# Altium schematic sheet Input.SchDoc
size A3; SheetNumber: 2; SheetTotal: 4
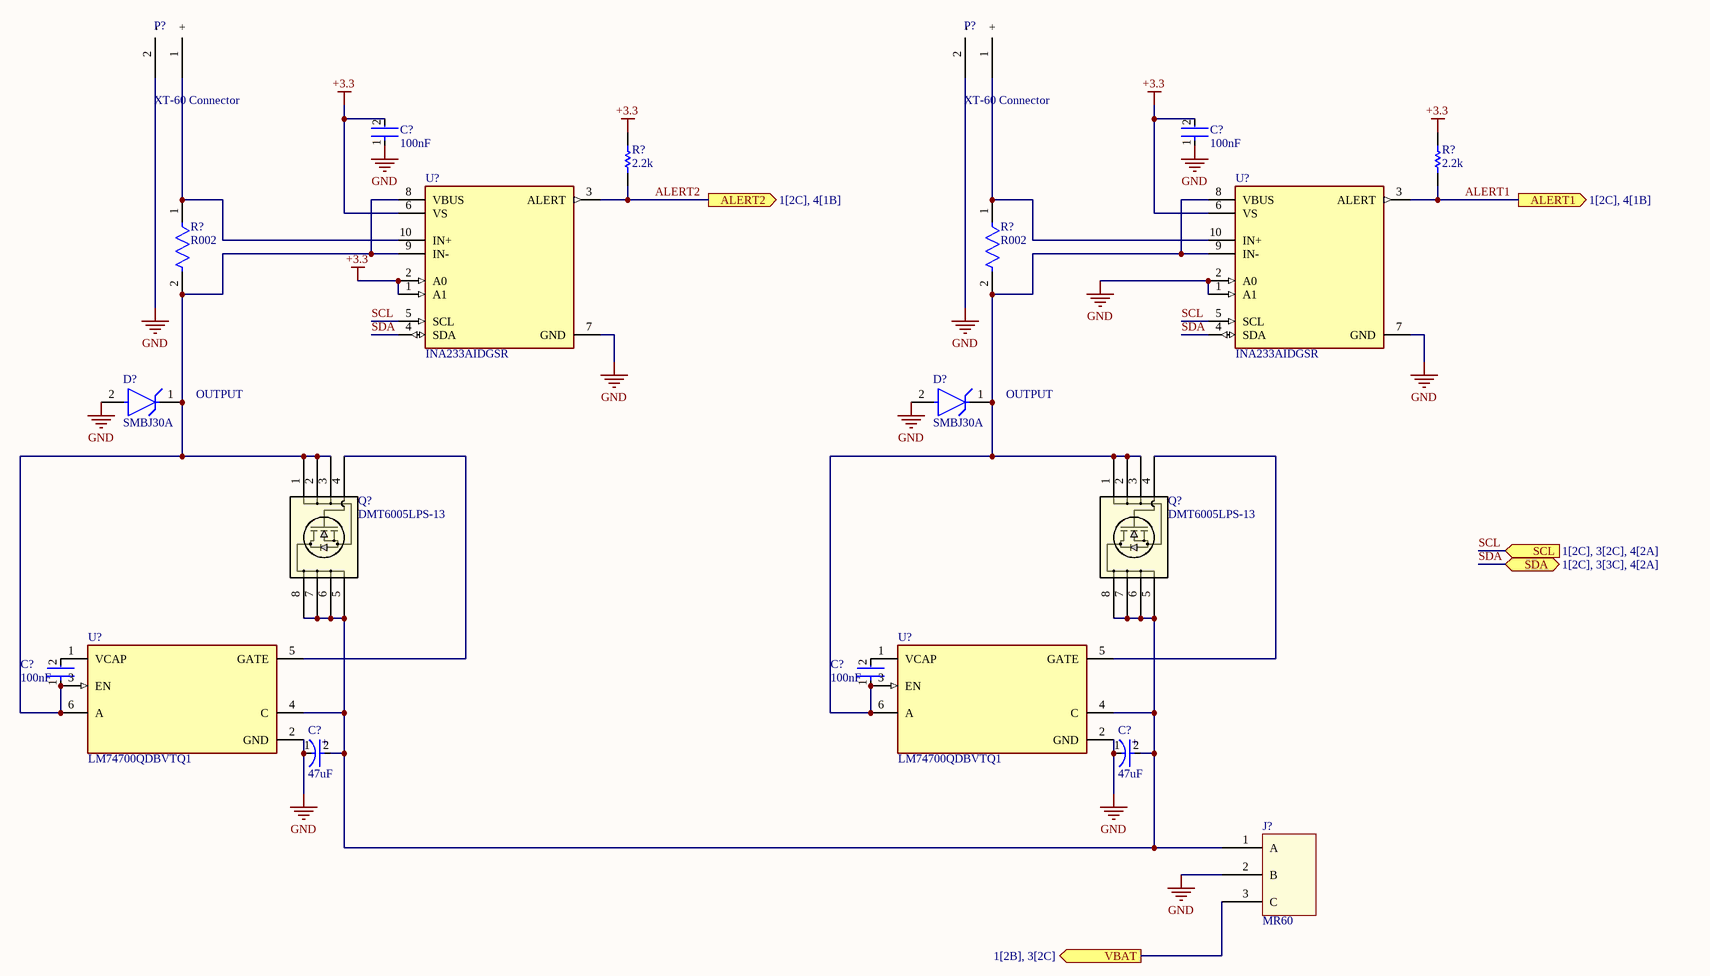
[diagram p0: Input.SchDoc]

## Parts
(Parts that share a designator on the sheet are numbered #1, #2 ... from top to bottom, then left to right.)
C?#1  100nF  [FP-0805-L_2_01_0_2-W_1_25-IPC_B]
C?#2  100nF  [FP-0805-L_2_01_0_2-W_1_25-IPC_B]
C?#3  100nF  [FP-0805-L_2_01_0_2-W_1_25-IPC_B]
C?#4  100nF  [FP-0805-L_2_01_0_2-W_1_25-IPC_B]
C?#5  47uF  [FP-SEV8X10_5-MFG]
C?#6  47uF  [FP-SEV8X10_5-MFG]
D?#1  SMBJ30A  [FP-SMBJ30A-E3-52-0]
D?#2  SMBJ30A  [FP-SMBJ30A-E3-52-0]
J?  MR60  [PCBComponent_1]
P?#1  XT-60 Connector  [2]
P?#2  XT-60 Connector  [2]
Q?#1  DMT6005LPS-13  [POWERDI5060-8_DIO-M]
Q?#2  DMT6005LPS-13  [POWERDI5060-8_DIO-M]
R?#1  2.2k  [RESC2013X60X35ML10T20]
R?#2  2.2k  [RESC2013X60X35ML10T20]
R?#3  R002  [FP-RL2512-MFG]
R?#4  R002  [FP-RL2512-MFG]
U?#1  INA233AIDGSR  [FP-DGS0010A-MFG]
U?#2  INA233AIDGSR  [FP-DGS0010A-MFG]
U?#3  LM74700QDBVTQ1  [FP-DBV0006A-MFG]
U?#4  LM74700QDBVTQ1  [FP-DBV0006A-MFG]

## Ports
ALERT1 (out, see 1[2C], 4[1B]), ALERT2 (out, see 1[2C], 4[1B]), SCL (in, see 1[2C], 3[2C], 4[2A]), SDA (bidir, see 1[2C], 3[3C], 4[2A]), VBAT (out, see 1[2B], 3[2C])

## Nets
+3.3: C?#1.2 C?#2.2 R?#1.2 R?#2.2 U?#1.1(A1) U?#1.2(A0) U?#1.6(VS) U?#2.6(VS)
GND: C?#1.1 C?#2.1 C?#5.1(C) C?#6.1(C) D?#1.2(A) D?#2.2(A) J?.2(B) P?#1.2(-) P?#2.2(-) U?#1.7(GND) U?#2.1(A1) U?#2.2(A0) U?#2.7(GND) U?#3.2(GND) U?#4.2(GND)
ALERT1: R?#2.1 U?#2.3(ALERT) ; port ALERT1
ALERT2: R?#1.1 U?#1.3(ALERT) ; port ALERT2
SCL: U?#1.5(SCL) U?#2.5(SCL) ; port SCL
SDA: U?#1.4(SDA) U?#2.4(SDA) ; port SDA
VBAT: J?.3(C) ; port VBAT
NetC?#3_1: C?#3.1 D?#1.1(C) Q?#1.1 Q?#1.2 Q?#1.3 R?#3.2 U?#1.8(VBUS) U?#1.9(IN-) U?#3.3(EN) U?#3.6(A)
NetC?#3_2: C?#3.2 U?#3.1(VCAP)
NetC?#4_1: C?#4.1 D?#2.1(C) Q?#2.1 Q?#2.2 Q?#2.3 R?#4.2 U?#2.8(VBUS) U?#2.9(IN-) U?#4.3(EN) U?#4.6(A)
NetC?#4_2: C?#4.2 U?#4.1(VCAP)
NetC?#5_2: C?#5.2(A) C?#6.2(A) J?.1(A) Q?#1.5 Q?#1.6 Q?#1.7 Q?#1.8 Q?#2.5 Q?#2.6 Q?#2.7 Q?#2.8 U?#3.4(C) U?#4.4(C)
NetP?#1_1: P?#1.1(+) R?#3.1 U?#1.10(IN+)
NetP?#2_1: P?#2.1(+) R?#4.1 U?#2.10(IN+)
NetQ?#1_4: Q?#1.4 U?#3.5(GATE)
NetQ?#2_4: Q?#2.4 U?#4.5(GATE)

## Notes on the sheet
- (near D?#1) OUTPUT
- (near D?#2) OUTPUT
- (in symbol CMP-35376-000024-1) +

## Library data of the parts
C?#1-C?#4 = CMP-2007-04174-2: General Purpose Ceramic Capacitor, 0805, 100nF, 10%, X7R, 15%, 100V; Packaging: Tape and Reel; Min Operating Temperature: -55°C; Dielectric Material: Ceramic; Height: 1.4mm; Voltage Rating: 100V; Termination: SMD/SMT; Case Code (Imperial): 0805; Case Code (Metric): 2012; Case/Package: 0805; Construction: Flat; Radiation Hardening: No; Series: -; Dielectric: X7R; Package Quantity: 2000; Mount: Surface Mount; Capacitance: 100nF; Contact Plating: Tin; Voltage: 100V; Lead Free: Lead Free; Depth: 1.25mm; RoHS Compliant: Yes; Number of Pins: 2; Max Operating Temperature: 125°C; Length: 2.01mm; Voltage Rating (DC): 100V; Thickness: 0.055inch; REACH SVHC: No SVHC; Width: 0.049inch; Tolerance: 10%
C?#5 C?#6 = CMP-35376-000024-1: CAP ALUM 47UF 20% 50V SMD; Polarity: Polar; Life (Hours): 2000Hour; Ripple Current: 240mA; Case/Package: Radial; Package Quantity: 1; Voltage Rating: 50V; Min Operating Temperature: -40°C; Capacitance: 47uF; Lead Pitch: 3.1mm; Height - Seated (Max): 0.413inch; Ratings: AEC-Q200; Lead Free: Lead Free; Construction: Cylindrical; Max Operating Temperature: 85°C; Packaging: Tape and Reel; RoHS Compliant: Yes; Mount: Surface Mount; Radiation Hardening: No; Tolerance: 20%; Series: SEV
D?#1 D?#2 = CMP-02577-000026-1: TVS DIODE 30VWM 48.4VC DO214AA; Polarity: Unidirectional; Clamping Voltage: 48.4V; Element Configuration: Single; Leakage Current: 1uA; Min Breakdown Voltage: 33.3V; Peak Pulse Power: 600W; Max Breakdown Voltage: 36.8V; Test Current: 1mA; Max Surge Current: 12.4A; Number of Unidirectional Channels: 1; Power Line Protection: No; Diode Type: ZENER; Operating Supply Voltage: 30V; Max Operating Temperature: 150°C; Number of Pins: 2; Series: TransZorb®; Min Operating Temperature: -55°C; Package Quantity: 750; Mount: Surface Mount; Resistor Type: Zener; Clamping Voltage-Max: 48.4V; Packaging: Tape and Reel; Length: 4.57mm; Direction: Unidirectional; Termination: SMD/SMT; Reverse Breakdown Voltage: 33.3V; Peak Pulse Current: 12.4A; Lead Free: Lead Free; Height: 2.24mm; RoHS Compliant: Yes; Breakdown Voltage: 36.8V; Max Power Dissipation: 600W; Power Dissipation: 600W; Max Reverse Leakage Current: 1uA; Reverse Standoff Voltage: 30V; Number of Channels: 1; Case/Package: DO-214AA; Width: 3.94mm; Number of Elements: 1; Radiation Hardening: No
J? = Component_1
P?#1 P?#2 = XT-60 Connector: Manufacturer: POLOLU; Manufacturer Part Number: XT60 YELLOW; Unit: pcs; SuppliedAmount: 0; MinAmount: 1; Type of robotics accessories: power connector; Maximum current: 65A; Information: Product is not a working device, but only component; Supplier 1: TME; Category: Power Supply Modules; Stock 1: 29; Pricing 1: 1=2.08, 10=1.95 (USD); Weight: 7.267; Multiples: 1; Number of pins: 2; Colour: yellow; Price Type: NET; ComponentLink1URL: http://static.tme.eu/products_pics/8/b/5/8b5040a8a5baf3e0e67386c2e3a9b903/913.jpg; ComponentLink1Description: http://static.tme.eu/products_pics/8/b/5/8b5040a8a5baf3e0e67386c2e3a9b903/913.jpg; Supplier Part Number 1: XT-60 Connector
Q?#1 Q?#2 = DMT6005LPS-13: No Description Available; Mfr_Name: Diodes Inc; Type: DEV; Copyright: Copyright (C) 2023 Ultra Librarian. All rights reserved.; Manufacturer_Part_Number: DMT6005LPS-13; RefDes: RefDes
R?#1 R?#2 = CMP-2100-03673-1: Chip Resistor, 0 Ohm, Jumper, +/- 5%, 0.125 W, -55 to 155 degC, 0805 (2012 Metric), RoHS, Tape and Reel; Manufacturer: Yageo; Power Rating: 125mW; Resistance: 0mOhm; Voltage Rating (DC): 150V; Temperature Coefficient: 200ppm/degreesC; Height: 0.5mm; Depth: 1.25mm; Case Code (Imperial): 0805; Lead Free: LeadFree; Military Standard: Not; Package Description: 2-Pin Surface Mounted Device, Body 2 x 1.25 mm; Case Code (Metric): 2012; Composition: ThickFilm; Voltage Rating: 150V; Manufacturer URL: http://www.yageo.com/; Packaging: TapeandReel; Package Reference: 0805; REACH SVHC: Unknown; Tolerance: 5%; Case/Package: 0805; Max Operating Temperature: 155degC; Number of Pins: 2; Min Operating Temperature: -55degC; RoHSCompliant: true; Length: 2mm; Datasheet URL: http://www.yageo.com/NewPortal/yageodocoutput?fileName=/pdf/R-Chip/PYu-RC_Group_51_RoHS_L_5.pdf; Termination: SMD/SMT; Radiation Hardening: No; Width: 1.25mm; Contact Plating: Tin; Datasheet Version: Rev. 5, 10/2016
R?#3 R?#4 = CMP-03412-013102-1: RES 0.1 OHM 1% 1W 2512; Manufacturer: YAGEO; Manufacturer Part Number: RL2512FK-070R1L; Automotive Grade: Grade 0; Temperature Coefficient: 600ppm/°C; Value: 100mΩ; Lead Free: Yes; Package: RL2512; Temperature Range High: +155°C; Octopart: https://octopart.com/rl2512fk-070r1l-yageo-42334369; Composition: Thick Film; Height: 0.65mm; ComponentLink2URL: http://www.yageo.com/documents/recent/PYu-RL_Group_521_RoHS_L_2.pdf; Device Class L3: Chip SMD Resistors; Automotive: Yes; Series: RL; Device Class L1: Passive Components; Device Class L2: Resistors; Mouser Description: Current Sense Resistors 0.1ohm 1% 1W; Temperature: -55°C to +155°C; ComponentLink2Description: Datasheet; Footprint Url: http://www.yageo.com/exep/pages/download/literatures/PYu-R_Mount_10.pdf; Ipc Land Pattern Name: RESC635320X55; RoHS: TRUE; Category: Res; Temperature Range Low: -55°C; Power Rating: 1W; Tolerance: 1%; Resistance: 100mΩ; Digikey Description: RES 0.1 OHM 1% 1W 2512
U?#1 U?#2 = CMP-04895-000095-1: Output Current: 10mA; Accuracy: 0.1%; Mount: Surface Mount; Case/Package: VSSOP; Min Operating Temperature: -40°C; Max Operating Temperature: 125°C; RoHS Compliant: Yes; Packaging: Tape and Reel
U?#3 U?#4 = CMP-04910-000068-1: LOW IQ, IDEAL DIODE CONTROLLER; Max Operating Temperature: 125°C; Min Operating Temperature: -40°C; RoHS Compliant: Yes